# EAGLE design mark1 (EAGLE 9.6.2)
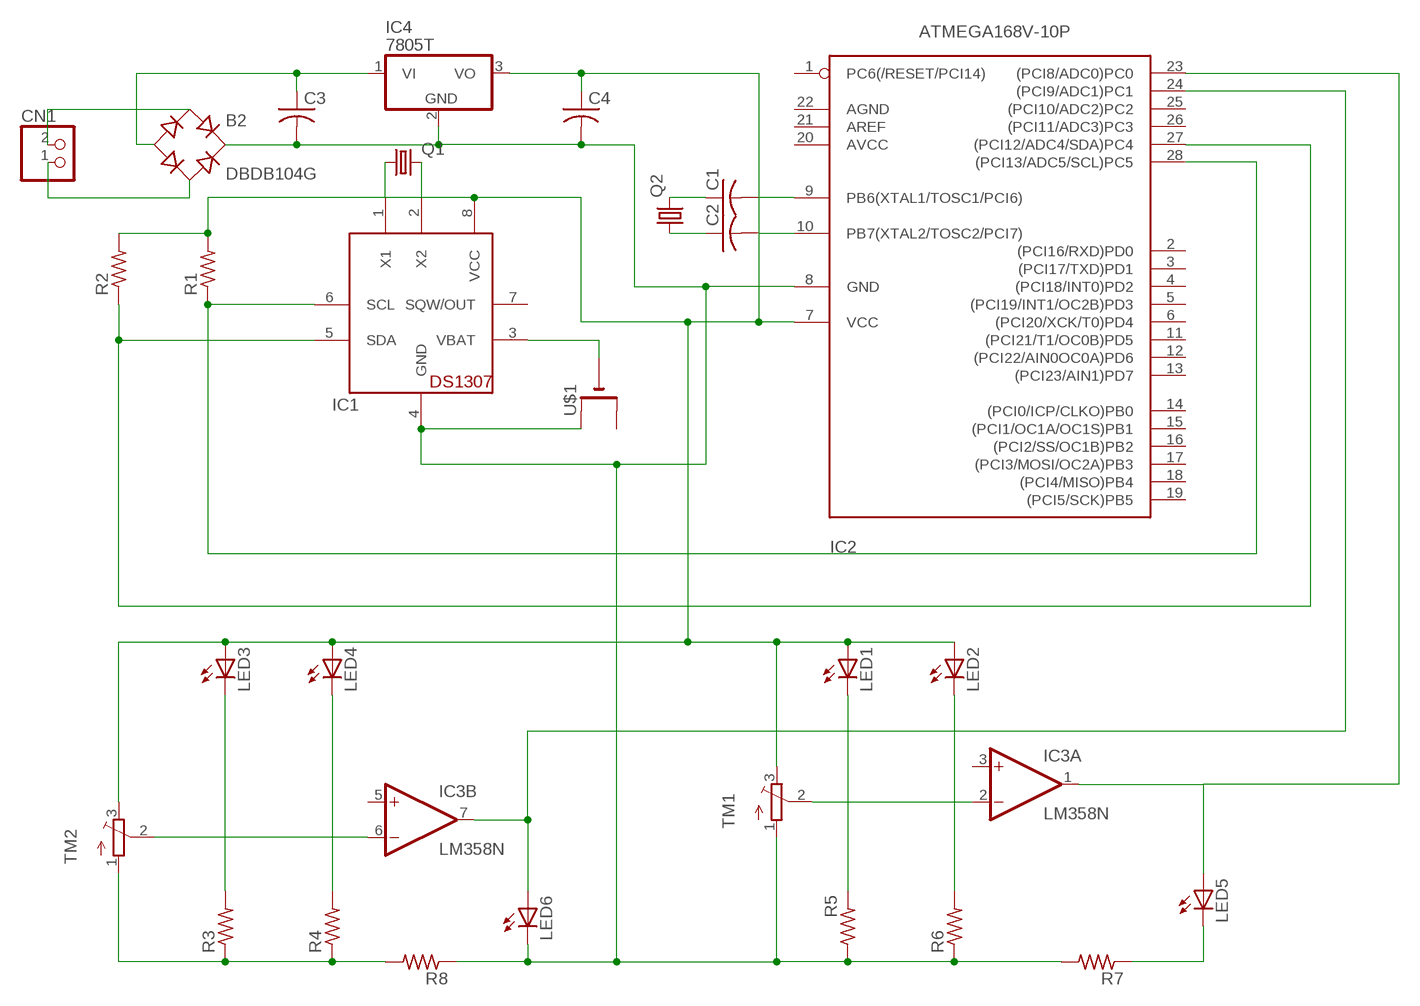
[diagram p0: schematic, sheet 1]

## Parts
B2  DBDB104G  [DB]
C1  C-US025-024X044  [C025-024X044]
C2  C-US025-024X044  [C025-024X044]
C3  C-US025-024X044  [C025-024X044]
C4  C-US025-024X044  [C025-024X044]
CN1  JST_2PIN-THM  [JST-PH-2-THM]
IC1  DS1307  [DIL08]
IC2  ATMEGA168V-10P  [DIL28-3]
IC3  LM358N  [DIL08]
IC4  7805T  [TO220H]
LED1  LED5MM  [LED5MM]
LED2  LED5MM  [LED5MM]
LED3  LED5MM  [LED5MM]
LED4  LED5MM  [LED5MM]
LED5  LED5MM  [LED5MM]
LED6  LED5MM  [LED5MM]
Q1  CRYSTALTC26V  [TC26V]
Q2  CRYSTALHC33U-V  [HC33U-V]
R1  R-US_0204/7  [0204/7]
R2  R-US_0204/7  [0204/7]
R3  R-US_0204/7  [0204/7]
R4  R-US_0204/7  [0204/7]
R5  R-US_0204/7  [0204/7]
R6  R-US_0204/7  [0204/7]
R7  R-US_0204/7  [0204/7]
R8  R-US_0204/7  [0204/7]
TM1  TRIMPOT3386  [TRIM-3386]
TM2  TRIMPOT3386  [TRIM-3386]
U$1  CR1220THM  [CR1220-THM]

## Nets
N$1: IC1.5(SDA) IC2.27((PCI12/ADC4/SDA)PC4) R2.1
N$2: IC1.6(SCL) IC2.28((PCI13/ADC5/SCL)PC5) R1.1
N$3: IC1.1(X1) Q1.1
N$4: IC1.2(X2) Q1.2
N$5: IC1.3(VBAT) U$1.-
N$6: B2.- C3.1 IC4.1(VI)
N$8: C1.2 IC2.9(PB6(XTAL1/TOSC1/PCI6))
N$9: C1.1 Q2.2
N$10: C2.1 Q2.1
N$11: C2.2 IC2.10(PB7(XTAL2/TOSC2/PCI7))
N$12: IC3.6(B:-IN) TM2.2(S)
N$13: IC3.2(A:-IN) TM1.2(S)
N$14: LED3.K(C) R3.2
N$15: LED4.K(C) R4.2
N$16: LED1.K(C) R5.2
N$17: LED2.K(C) R6.2
N$18: IC2.24((PCI9/ADC1)PC1) IC3.7(B:OUT) LED6.A
N$20: R3.1 R4.1 R8.2 TM2.1(A)
N$21: B2.+ C3.2 C4.2 IC1.4(GND) IC2.8(GND) IC4.2(GND) LED6.K(C) R5.1 R6.1 R7.2 R8.1 TM1.1(A) U$1.+1(+)
N$22: IC2.23((PCI8/ADC0)PC0) IC3.1(A:OUT) LED5.A
N$23: LED5.K(C) R7.1
N$24: C4.1 IC1.8(VCC) IC2.7(VCC) IC4.3(VO) LED1.A LED2.A LED3.A LED4.A R1.2 R2.2 TM1.3(E) TM2.3(E)
N$25: B2.AC1 CN1.2
N$26: B2.AC2 CN1.1
Unconnected: IC1.7(SQW/OUT) IC2.1(PC6(/RESET/PCI14)) IC2.2((PCI16/RXD)PD0) IC2.3((PCI17/TXD)PD1) IC2.4((PCI18/INT0)PD2) IC2.5((PCI19/INT1/OC2B)PD3) IC2.6((PCI20/XCK/T0)PD4) IC2.11((PCI21/T1/OC0B)PD5) IC2.12((PCI22/AIN0OC0A)PD6) IC2.13((PCI23/AIN1)PD7) IC2.14((PCI0/ICP/CLKO)PB0) IC2.15((PCI1/OC1A/OC1S)PB1) IC2.16((PCI2/SS/OC1B)PB2) IC2.17((PCI3/MOSI/OC2A)PB3) IC2.18((PCI4/MISO)PB4) IC2.19((PCI5/SCK)PB5) IC2.20(AVCC) IC2.21(AREF) IC2.22(AGND) IC2.25((PCI10/ADC2)PC2) IC2.26((PCI11/ADC3)PC3) IC3.3(A:+IN) IC3.5(B:+IN) U$1.+2(+1)

## Power pins joined to a net without a drawn wire
V+: IC3.8(P:V+)
V-: IC3.4(P:V-)

## Library data of the parts
B2 = rectifier:DB?*G: Single Phase 1.0 AMP Glass Passivated Bridge Rectifier Taiwan Semiconductor Co.,Ltd. - TSC Source: http://www.taiwansemi.com/TSCbig5/ezcatfiles/cust/img/img/db101g.pdf http://www.ts.com.tw/db/pictures/modules/PDT/PDT060207001/DBLS201G.pdf
C1-C4 = adafruit:C-US: CAPACITOR, American symbol
CN1 = adafruit:JST_2PIN: JST 2-Pin Connectors of various flavors SMT-RA (S2B-PH-SM4) 4UConnector #17311 SMT (B2B-PH-SM4) THM-RA (S2B-PH) THM (B2B-PH)
IC1 = adafruit:DS1307: DS1307 Real time clock (RTC) with battery backup ability. Talk to it via i2c
IC2 = adafruit:ATMEGA168*P: MICROCONTROLLER 16 kBytes FLASH 1 kBytes SRAM 512 Bytes EEPROM USART 8-channel 10 bit ADC
IC3 = linear:LM358: OP AMP also LM158; LM258; LM2904 Source: http://cache.national.com/ds/LM/LM158.pdf
IC4 = adafruit:78*: Positive VOLTAGE REGULATOR Added bigger pads to the TO-92 package
LED1-LED6 = adafruit:LED: LED OSRAM: - CHIPLED LG R971, LG N971, LY N971, LG Q971, LY Q971, LO R971, LY R971 LH N974, LH R974 LS Q976, LO Q976, LY Q976 LO Q996 - Hyper CHIPLED LW Q18S LB Q993, LB Q99A, LB R99A - SideLED LS A670, LO A670, LY A670, LG A670, LP A670 LB A673, LV A673, LT A673, LW A673 LH A674 LY A675 LS A676, LA A676, LO A676, LY A676, LW A676 LS A679, LY A679, LG A679 - Hyper Micro SIDELED® LS Y876, LA Y876, LO Y876, LY Y876 LT Y87S - SmartLED LW L88C, LW L88S LB L89C, LB L89S, LG L890 LS L89K, LO L89K, LY L89K LS L896, LA L896, LO L896, LY L896 - TOPLED LS T670, LO T670, LY T670, LG T670, LP T670 LSG T670, LSP T670, LSY T670, LOP T670, LYG T670 LG T671, LOG T671, LSG T671 LB T673, LV T673, LT T673, LW T673 LH T674 LS T676, LA T676, LO T676, LY T676, LB T676, LH T676, LSB T676, LW T676 LB T67C, LV T67C, LT T67C, LS T67K, LO T67K, LY T67K, LW E67C LS E67B, LA E67B, LO E67B, LY E67B, LB E67C, LV E67C, LT E67C LW T67C LS T679, LY T679, LG T679 LS T770, LO T770, LY T770, LG T770, LP T770 LB T773, LV T773, LT T773, LW T773 LH T774 LS E675, LA E675, LY E675, LS T675 LS T776, LA T776, LO T776, LY T776, LB T776 LHGB T686 LT T68C, LB T68C - Hyper Mini TOPLED® LB M676 - Mini TOPLED Santana® LG M470 LS M47K, LO M47K, LY M47K Source: http://www.osram.convergy.de/
Q1 Q2 = adafruit:CRYSTAL: CRYSTAL; OC_FARNELL: unknown; OC_NEWARK: unknown
R1-R8 = adafruit:R-US_: RESISTOR, American symbol
TM1 TM2 = adafruit:TRIMPOT: SMT trimmer potentiometer part number TC33X http://www.ladyada.net/library/eagle
U$1 = adafruit:CR1220: CR1216/CR1220/CR1225 12mm 3V lithium coin cell Great for battery packup. Both SMT and THM holders. Note the THM package has the ground pads on both sides of the PCB so that the masks are the same - this reduces the cost

## Board
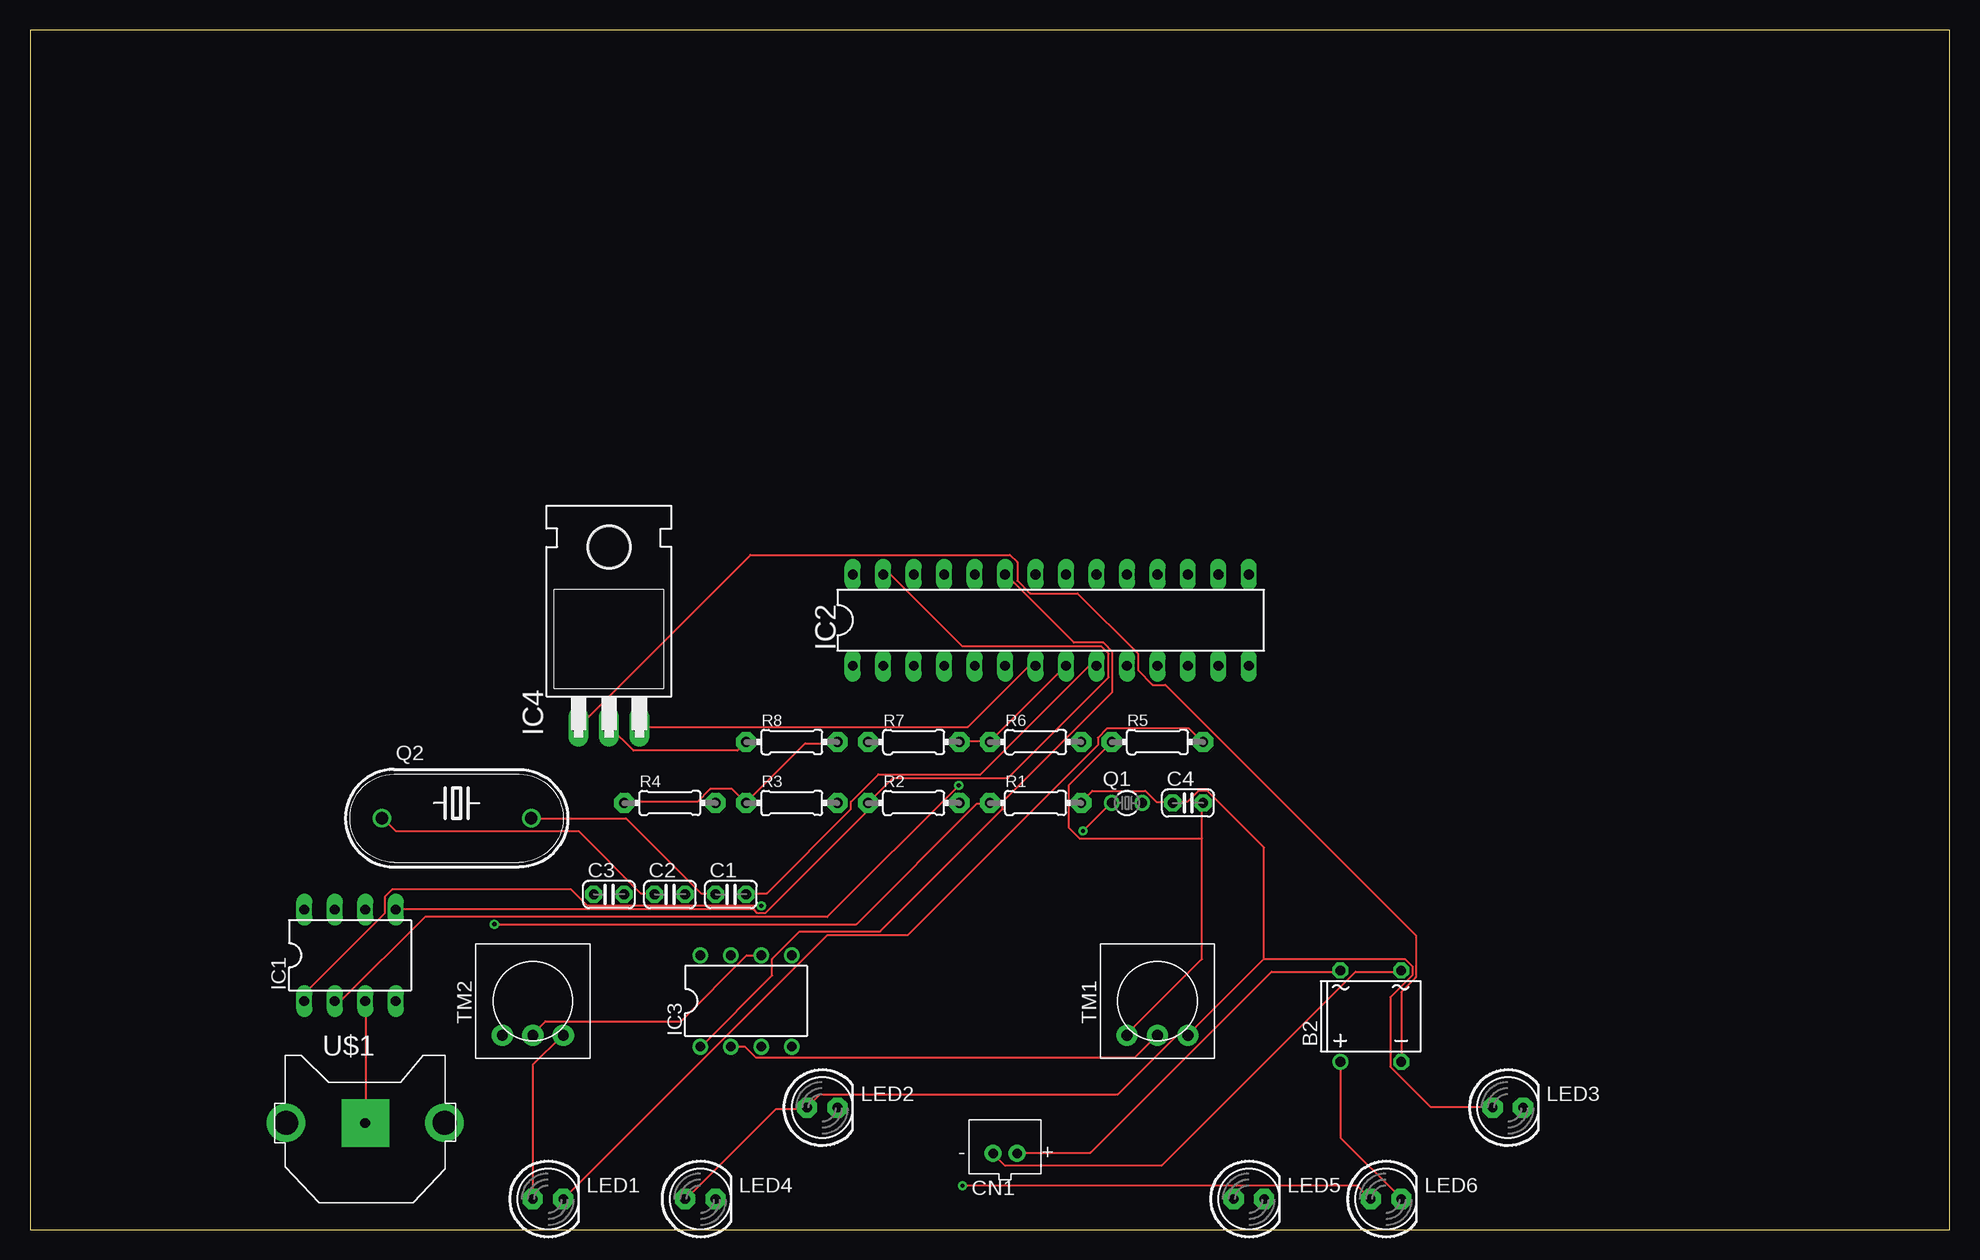
[diagram p1: board, top side]
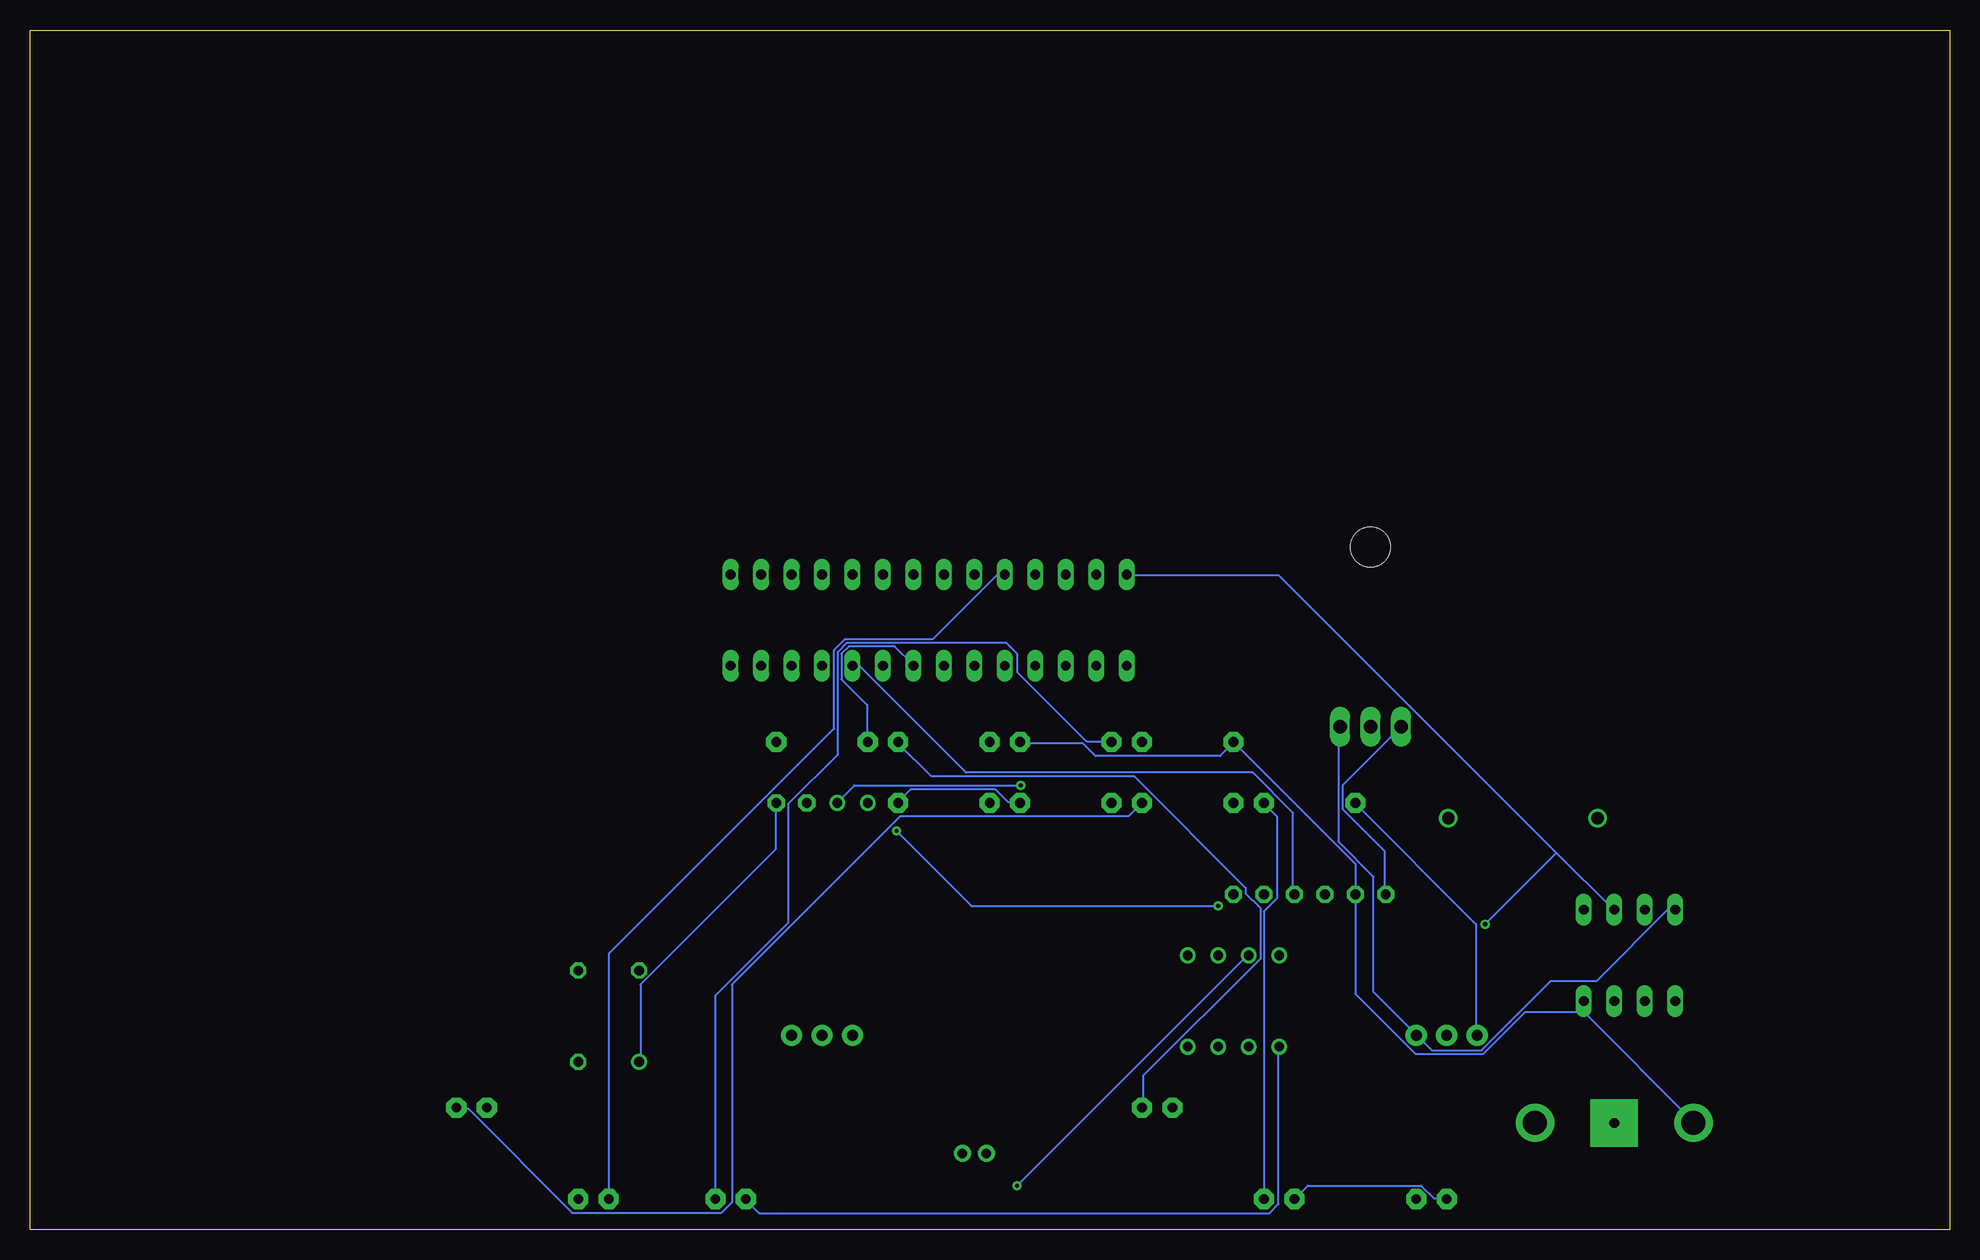
[diagram p2: board, bottom side, seen from below]

Size 160 x 100 mm. Coordinates in mm from the lower left corner, seen from the top.
Outline: 0,0 160,0 160,100 0,100 0,0
Copper layers (1*16): Top 0.035mm / dielectric 1.5mm / Bottom 0.035mm
Design rules "default": minimum track width 6mil, minimum drill 0.35mm, track to track 6mil, track to pad 6mil, pad to pad 6mil, via to via 6mil, smd to smd 6mil, copper to edge 40mil, drill to drill 6mil, minimum pad ring 10mil, minimum via ring 8mil, stop-mask expansion 4mil, vias tented up to drill 0mil, thermal gap 10mil

### Footprints (pad centres in the part's own frame; a part is rotated, then mirrored left to right if it is on the bottom)
DB = drill 0.813: + -2.54,-3.81 | drill 0.813 octagon: - 2.54,-3.81; AC1 2.54,3.81; AC2 -2.54,3.81
C025-024X044 = drill 0.813 pad 1.422 octagon: 1 -1.27,0; 2 1.27,0
JST-PH-2-THM = drill 0.8 pad 1.422: 1 1,0; 2 -1,0
DIL08 = drill 0.813 long: 1 -3.81,-3.81; 2 -1.27,-3.81; 3 1.27,-3.81; 4 3.81,-3.81; 5 3.81,3.81; 6 1.27,3.81; 7 -1.27,3.81; 8 -3.81,3.81
DIL28-3 = drill 0.813 long: 1 -16.51,-3.81; 2 -13.97,-3.81; 3 -11.43,-3.81; 4 -8.89,-3.81; 5 -6.35,-3.81; 6 -3.81,-3.81; 7 -1.27,-3.81; 8 1.27,-3.81; 9 3.81,-3.81; 10 6.35,-3.81; 11 8.89,-3.81; 12 11.43,-3.81; 13 13.97,-3.81; 14 16.51,-3.81; 15 16.51,3.81; 16 13.97,3.81; 17 11.43,3.81; 18 8.89,3.81; 19 6.35,3.81; 20 3.81,3.81; 21 1.27,3.81; 22 -1.27,3.81; 23 -3.81,3.81; 24 -6.35,3.81; 25 -8.89,3.81; 26 -11.43,3.81; 27 -13.97,3.81; 28 -16.51,3.81
DIL08' = drill 0.813 pad 1.27: 1 -3.81,-3.81; 2 -1.27,-3.81; 3 1.27,-3.81; 4 3.81,-3.81; 5 3.81,3.81; 6 1.27,3.81; 7 -1.27,3.81; 8 -3.81,3.81
TO220H = drill 1.118 long: 1 -2.54,-10.16; 2 0,-10.16; 3 2.54,-10.16 | hole 3.302: 0,4.826
LED5MM = drill 0.813 pad 1.676 octagon: A -1.27,0; K 1.27,0
TC26V = drill 0.813: 1 -1.27,0; 2 1.27,0
HC33U-V = drill 1.016: 1 -6.223,0; 2 6.223,0
0204/7 = drill 0.813 pad 1.676 octagon: 1 -3.81,0; 2 3.81,0
TRIM-3386 = drill 0.9 pad 1.778: 1 -2.54,-2.857; 2 0,-2.857; 3 2.54,-2.857
CR1220-THM = drill 2 pad 3.175: +1 -6.604,0; +2 6.604,0 | drill 0.8 pad 3.962 square: - 0,0

### Placement (x,y rotation side)
B2  111.76,17.78 0 top
C1  58.42,27.94 0 top
C2  53.34,27.94 0 top
C3  48.26,27.94 0 top
C4  96.52,35.56 0 top
CN1  81.28,6.35 0 top
IC1  26.67,22.86 0 top
IC2  85.09,50.8 0 top
IC3  LM358N  [DIL08']  59.69,19.05 0 top
IC4  48.26,52.07 0 top
LED1  43.18,2.54 0 top
LED2  66.04,10.16 0 top
LED3  123.19,10.16 0 top
LED4  55.88,2.54 0 top
LED5  101.6,2.54 0 top
LED6  113.03,2.54 0 top
Q1  91.44,35.56 0 top
Q2  35.56,34.29 0 top
R1  83.82,35.56 0 top
R2  73.66,35.56 0 top
R3  63.5,35.56 0 top
R4  53.34,35.56 0 top
R5  93.98,40.64 0 top
R6  83.82,40.64 0 top
R7  73.66,40.64 0 top
R8  63.5,40.64 0 top
TM1  93.98,19.05 0 top
TM2  41.91,19.05 0 top
U$1  27.94,8.89 0 top

### Tracks (layer width: path | path; a pad name or v marks a point on that pad's centre or on a via)
N$1
  Top 0.152: IC1.5 60.35,26.67 60.66,26.36 61.27,26.36 69.8,34.9 69.8,35.51 R2.1 71.93,37.64 81.53,37.64 89.92,46.02 89.92,48.01 89.31,48.62 77.72,48.62 71.78,54.56 71.17,54.56 IC2.27
N$2  (via drill 0.35)
  Top 0.152: v38.71,25.45 68.89,25.45 78.94,35.51 80.01,35.51 R1.1
  Bottom 0.152: 32.77,31.39 55.93,54.56 68.58,54.56 IC2.28 | 32.77,31.39 28.04,26.67 IC1.6 | 32.77,31.39 v38.71,25.45
N$3  (via drill 0.35)
  Top 0.152: IC1.1 22.86,19.66 29.57,26.36 29.57,27.74 30.18,28.35 45.11,28.35 46.48,26.98 v60.96,26.98 | v87.78,33.22 90.07,35.51 Q1.1
  Bottom 0.152: v60.96,26.98 81.53,26.98 v87.78,33.22
N$4  (via drill 0.35)
  Top 0.152: IC1.2 25.91,19.05 32.92,26.06 66.45,26.06 v77.42,37.03
  Bottom 0.152: v77.42,37.03 91.29,37.03 92.66,35.66 Q1.2
N$5
  Top 0.152: IC1.3 28.04,19.05 28.04,8.99 U$1.-
N$6
  Top 0.152: B2.- 114.3,19.81 115.52,21.03 115.52,24.54 94.64,45.41 93.57,45.41 92.35,46.63 92.35,48.01 87.33,53.03 83.36,53.03 82.3,54.1 82.3,55.63 81.69,56.24 60.05,56.24 IC4.1
  Bottom 0.152: IC4.1 50.6,37.03 50.6,35.05 47.09,31.55 47.09,28.04 C3.1
N$8
  Top 0.152: IC2.9 88.85,46.94 88.24,46.94 79.25,37.95 70.71,37.95 68.43,35.66 68.43,35.05 61.42,28.04 59.74,28.04 C1.2
N$9
  Top 0.152: Q2.2 49.68,34.29 55.93,28.04 57.15,28.04 C1.1
N$10
  Top 0.152: C2.1 51.97,28.04 50.9,28.04 45.72,33.22 30.48,33.22 29.41,34.29 Q2.1
N$11
  Bottom 0.152: IC2.10 91.44,46.94 90.83,46.94 81.99,38.1 58.06,38.1 54.71,34.75 54.71,28.04 C2.2
N$12
  Top 0.152: IC3.6 59.74,22.86 54.25,17.37 42.98,17.37 41.91,16.31 TM2.2
N$13
  Top 0.152: IC3.2 59.59,15.24 60.5,14.33 92.05,14.33 93.88,16.15 TM1.2
N$14
  Bottom 0.152: R3.2 68.43,34.44 87.48,34.44 101.5,20.42 101.5,2.29 102.41,1.37 114.76,1.37 123.44,10.06 124.36,10.06 LED3.K
N$15
  Bottom 0.152: LED4.K 57.15,26.52 56.08,27.58 56.08,34.44 57.15,35.51 R4.2
N$16
  Top 0.152: LED1.K 66.45,24.54 73.15,24.54 89,40.39 89,41 89.76,41.76 96.62,41.76 97.69,40.69 R5.2
N$17
  Bottom 0.152: LED2.K 67.21,10.21 67.21,12.8 57.45,22.55 57.45,26.82 58.67,28.04 58.67,28.5 67.97,37.8 84.89,37.8 87.63,40.54 R6.2
N$18  (via drill 0.35)
  Top 0.152: v77.72,3.66 110.64,3.66 LED6.A
  Bottom 0.152: v77.72,3.66 58.52,22.86 IC3.7 | IC2.24 78.79,54.56 79.4,54.56 84.73,49.23 92.05,49.23 92.96,48.31 92.96,41.76 111.71,23.01 111.71,2.59 LED6.A
N$20
  Top 0.152: R4.1 49.53,35.66 55.63,35.66 56.69,36.73 58.52,36.73 R3.1 59.74,35.66 64.62,40.54 67.21,40.54 R8.2
  Bottom 0.152: TM2.1 39.47,16.31 39.47,25.45 49.53,35.51 R4.1
N$21
  Top 0.152: B2.+ 109.27,13.87 109.27,7.62 114.3,2.59 LED6.K | 97.69,32.61 97.69,22.55 91.44,16.31 TM1.1 | 97.69,32.61 97.69,35.51 C4.2 | 80.01,40.69 86.26,46.94 IC2.8 | 80.01,40.69 77.57,40.69 R7.2 | 80.01,40.69 R6.1 | R8.1 58.98,39.93 50.29,39.93 48.31,41.91 IC4.2 | 97.69,32.61 87.48,32.61 86.56,33.53 86.56,37.03 R5.1
  Bottom 0.152: B2.+ 109.12,14.02 109.12,20.42 97.84,31.7 97.84,35.51 C4.2 | 30.48,18.14 21.34,8.99 U$1.+1 | R5.1 90.22,40.69 90.22,43.74 92.35,45.87 92.35,48.01 91.75,48.62 87.94,48.62 86.41,47.09 IC2.8 | R7.2 77.42,40.54 72.24,40.54 71.17,39.47 60.81,39.47 59.74,40.54 R8.1 49.53,30.48 C3.2 49.53,19.66 44.5,14.63 38.86,14.63 35.36,18.14 30.48,18.14 | 30.48,18.14 IC1.4
N$22
  Top 0.152: IC2.23 81.38,54.56 87.02,48.92 89.46,48.92 90.22,48.16 90.22,44.81 81.08,35.66 81.08,35.05 70.87,24.84 64.16,24.84 61.87,22.55 61.87,21.18 55.93,15.24 IC3.1
  Bottom 0.152: IC3.1 55.93,15.24 55.93,2.13 56.69,1.37 99.21,1.37 100.28,2.44 LED5.A
N$23
  Bottom 0.152: LED5.K 102.87,19.51 96.77,25.6 96.77,35.51 92.66,39.62 92.66,48.16 91.9,48.92 78.64,48.92 77.72,48.01 77.72,46.48 71.93,40.69 69.95,40.69 R7.1
N$24
  Top 0.152: 95.25,35.66 93.88,35.66 92.96,36.58 88.54,36.58 87.63,35.66 R1.2 | 102.87,22.55 114.61,22.55 115.21,21.95 115.21,21.18 113.39,19.36 113.39,13.56 116.74,10.21 121.92,10.21 LED3.A | 102.87,22.55 96.62,16.31 TM1.3 96.47,16.15 95.56,16.15 90.68,11.28 65.84,11.28 64.77,10.21 LED2.A 64.77,10.06 62.18,10.06 54.71,2.59 LED4.A | 95.25,35.66 96.47,35.66 97.38,36.58 98.15,36.58 102.87,31.85 102.87,22.55 | 95.25,35.66 C4.1 | IC4.3 78.18,41.91 83.21,46.94 83.82,46.94 IC2.7 | LED1.A 41.91,13.72 44.35,16.15 TM2.3
  Bottom 0.152: R2.2 77.57,35.66 78.49,35.66 79.55,36.73 86.56,36.73 87.63,35.66 R1.2 | LED4.A 53.49,3.66 44.04,3.66 42.98,2.59 41.91,2.59 LED1.A | IC1.8 23.47,26.67 29.41,20.73 33.22,20.73 39.01,14.94 43.13,14.94 44.35,16.15 TM2.3 44.5,16.31 48.01,19.81 48.01,29.41 50.9,32.31 50.9,41.91 IC4.3
N$25
  Top 0.152: B2.AC1 114.3,21.49 110.49,21.49 94.34,5.33 81.23,5.33 80.31,6.25 CN1.2
N$26
  Top 0.152: B2.AC2 109.12,21.49 103.48,21.49 88.39,6.4 82.3,6.4 CN1.1